# Altium project GumstixUAVBoard.PrjPcb
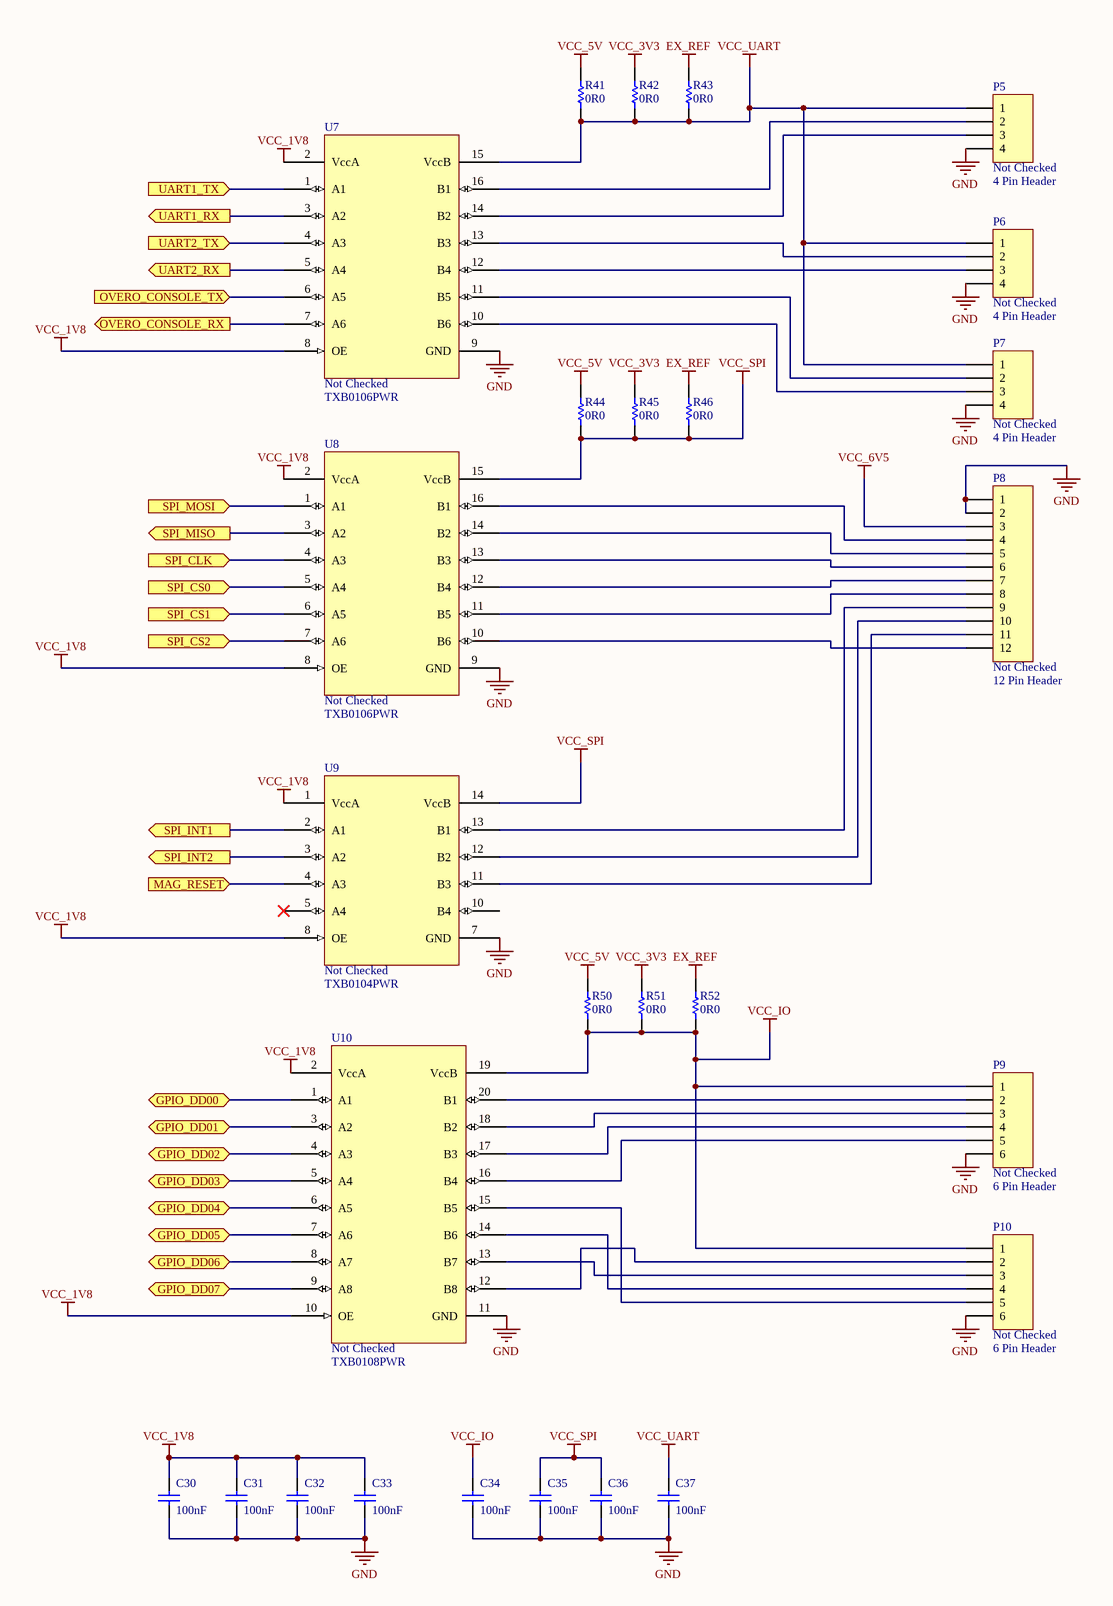
[diagram p0: Level Shifters.SchDoc]
5 sheets, 130 parts. Net scope: flat (ports and power ports of the same name join across sheets).
Board file: PCB1.PcbDoc
Sheets:
  Level Shifters.SchDoc
  Bus UART.SchDoc
  USB SPI I2C.SchDoc
  Power.SchDoc
  Overo.SchDoc

## Sheet Level Shifters.SchDoc
size A3 portrait; PageSetup: Record=PageOptions|CenterHorizontal=True|CenterVertical=True|PrintScale=1.00|XCorrection=1.00|YCorrection=1.00|PrintKind=1|BorderSize=5000000|LeftOffset=0|BottomOffset=0|Orientation=1|PaperLength=1000|PaperWidth=1000|Scale=100|PaperSource=7|PrintQuality=-4|MediaType=1|DitherType=10|PaperKind=A4|PrintScaleMode=1

### Parts
C30  100nF  [0603]
C31  100nF  [0603]
C32  100nF  [0603]
C33  100nF  [0603]
C34  100nF  [0603]
C35  100nF  [0603]
C36  100nF  [0603]
C37  100nF  [0603]
P5  Verify: Not Checked  [CONN_4X1_SMT_RA_1.25MM]  (hidden comment: 4 Pin Header)
P6  Verify: Not Checked  [CONN_4X1_SMT_RA_1.25MM]  (hidden comment: 4 Pin Header)
P7  Verify: Not Checked  [CONN_4X1_SMT_RA_1.25MM]  (hidden comment: 4 Pin Header)
P8  Verify: Not Checked  [CONN_12X1_SMT_RA_1.25MM]  (hidden comment: 12 Pin Header)
P9  Verify: Not Checked  [CONN_6X1_SMT_RA_1.25MM]  (hidden comment: 6 Pin Header)
P10  Verify: Not Checked  [CONN_6X1_SMT_RA_1.25MM]  (hidden comment: 6 Pin Header)
R41  0R0  [0603]  (no BOM)
R42  0R0  [0603]  (no BOM)
R43  0R0  [0603]  (no BOM)
R44  0R0  [0603]  (no BOM)
R45  0R0  [0603]  (no BOM)
R46  0R0  [0603]  (no BOM)
R50  0R0  [0603]  (no BOM)
R51  0R0  [0603]  (no BOM)
R52  0R0  [0603]  (no BOM)
U7  value TXB0106PWR  Verify: Not Checked  [TSSOP-16_PW]  (hidden comment: IC_TXB0106PWR)
U8  value TXB0106PWR  Verify: Not Checked  [TSSOP-16_PW]  (hidden comment: IC_TXB0106PWR)
U9  value TXB0104PWR  Verify: Not Checked  [TSSOP-14_PW]  (hidden comment: IC_TXB0104PWR)
U10  value TXB0108PWR  Verify: Not Checked  [TSSOP-20_PW]  (hidden comment: IC_TXB0108PWR)

### Ports
GPIO_DD00 (bidir), GPIO_DD01 (bidir), GPIO_DD02 (bidir), GPIO_DD03 (bidir), GPIO_DD04 (bidir), GPIO_DD05 (bidir), GPIO_DD06 (bidir), GPIO_DD07 (bidir), MAG_RESET (in), OVERO_CONSOLE_RX (out), OVERO_CONSOLE_TX (in), SPI_CLK (in), SPI_CS0 (in), SPI_CS1 (in), SPI_CS2 (in), SPI_INT1 (out), SPI_INT2 (out), SPI_MISO (out), SPI_MOSI (in), UART1_RX (out), UART1_TX (in), UART2_RX (out), UART2_TX (in)

### Nets
EX_REF: R43.1 R46.1 R52.1
GND: C30.1 C31.1 C32.1 C33.1 C34.1 C35.1 C36.1 C37.1 P5.4 P6.4 P7.4 P8.1 P8.2 P9.6 P10.6 U7.9(GND) U8.9(GND) U9.7(GND) U10.11(GND)
VCC_1V8: C30.2 C31.2 C32.2 C33.2 U7.2(VccA) U7.8(OE) U8.2(VccA) U8.8(OE) U9.1(VccA) U9.8(OE) U10.2(VccA) U10.10(OE)
VCC_3V3: R42.1 R45.1 R51.1
VCC_5V: R41.1 R44.1 R50.1
VCC_6V5: P8.3
VCC_IO: C34.2 P9.1 P10.1 R50.2 R51.2 R52.2 U10.19(VccB)
VCC_SPI: C35.2 C36.2 R44.2 R45.2 R46.2 U8.15(VccB) U9.14(VccB)
VCC_UART: C37.2 P5.1 P6.1 P7.1 R41.2 R42.2 R43.2 U7.15(VccB)
NetJP1_2: U10.3(A2) ; port GPIO_DD01
NetJP1_3: U10.1(A1) ; port GPIO_DD00
NetJP1_4: U10.5(A4) ; port GPIO_DD03
NetJP1_5: U10.7(A6) ; port GPIO_DD05
NetJP1_6: U10.4(A3) ; port GPIO_DD02
NetJP1_7: U10.6(A5) ; port GPIO_DD04
NetJP1_26: U7.6(A5) ; port OVERO_CONSOLE_TX
NetJP1_29: U10.9(A8) ; port GPIO_DD07
NetJP1_31: U7.7(A6) ; port OVERO_CONSOLE_RX
NetJP1_33: U10.8(A7) ; port GPIO_DD06
NetJP1_42_: U8.6(A5) ; port SPI_CS1
NetJP1_43_: U8.4(A3) ; port SPI_CLK
NetJP1_44_: U8.1(A1) ; port SPI_MOSI
NetJP1_45_: U8.3(A2) ; port SPI_MISO
NetJP1_57: U9.4(A3) ; port MAG_RESET
NetJP1_60: U9.3(A2) ; port SPI_INT2
NetJP1_61: U9.2(A1) ; port SPI_INT1
NetJP1__25: U8.7(A6) ; port SPI_CS2
NetJP1__27: U8.5(A4) ; port SPI_CS0
NetP5_2: P5.2 U7.16(B1)
NetP5_3: P5.3 U7.14(B2)
NetP6_2: P6.2 U7.13(B3)
NetP6_3: P6.3 U7.12(B4)
NetP7_2: P7.2 U7.11(B5)
NetP7_3: P7.3 U7.10(B6)
NetP8_4: P8.4 U8.16(B1)
NetP8_5: P8.5 U8.14(B2)
NetP8_6: P8.6 U8.13(B3)
NetP8_7: P8.7 U8.12(B4)
NetP8_8: P8.8 U8.11(B5)
NetP8_9: P8.9 U9.13(B1)
NetP8_10: P8.10 U9.12(B2)
NetP8_11: P8.11 U9.11(B3)
NetP8_12: P8.12 U8.10(B6)
NetP9_2: P9.2 U10.20(B1)
NetP9_3: P9.3 U10.18(B2)
NetP9_4: P9.4 U10.17(B3)
NetP9_5: P9.5 U10.16(B4)
NetP10_2: P10.2 U10.12(B8)
NetP10_3: P10.3 U10.13(B7)
NetP10_4: P10.4 U10.14(B6)
NetP10_5: P10.5 U10.15(B5)
NetU5_4: U7.5(A4) ; port UART2_RX
NetU5_5: U7.3(A2) ; port UART1_RX
NetU5_7: U7.1(A1) ; port UART1_TX
NetU5_8: U7.4(A3) ; port UART2_TX

Not connected (* = marked no-connect by the designer): U9 5(A4)* 10(B4)

### Library data of the parts
C30-C37 = CP_100nF 0603: CAP CER .10UF 50V X5R 0603; Manufacturer: Taiyo Yuden; Manufacturer PN: UMK107B7104KA-T; Prototype: Digikey 587-1243-1-ND; LatestRevisionDate: 29 May 08; Value: 100nF
P5-P7 = JP_4PIN HDR_SMT_RA_MOLEX: CONN HDR VERT 4POS .100" SNGL; Manufacturer: Molex; Manufacturer PN: 53261-0471; Prototype: Digikey WM7622CT-ND; LatestRevisionDate: 24 Jun 08; Value: 4 Pin Header
P8 = JP_12PIN HDR_SMT_RA_MOLEX: CONN HDR VERT 12POS .100" SNGL; Manufacturer: Molex; Manufacturer PN: 53261-1271; Prototype: Digikey WM7630CT-ND; LatestRevisionDate: 24 Jun 08; Value: 12 Pin Header
P9 P10 = JP_6PIN HDR_SMT_RA_MOLEX: CONN HDR VERT 6POS .100" SNGL; Manufacturer: Molex; Manufacturer PN: 53261-0671; Prototype: Digikey WM7624CT-ND; LatestRevisionDate: 24 Jun 08; Value: 6 Pin Header
R41-R46 R50-R52 = RS_0R0 0603: RES 0.0 OHM 1/10W 5% 0603 SMD; Manufacturer: Rohm; Manufacturer PN: MCR03EZPJ000; Prototype: DigiKey RHM0.0GCT-ND; LatestRevisionDate: 3 Jun 08; Value: 0R0
U7 U8 = IC_TXB0106PWR: IC VOLT-LEVEL TRANSLATOR 16TSSOP; Manufacturer: Texas Instruments; Prototype: Digikey 296-23759-1-ND; LastRevisionDate: n/a; Manufacturer PN: TXB0106PWR
U9 = IC_TXB0104PWR: IC VOLT-LEVEL TRANSLATOR 14TSSOP; Manufacturer: Texas Instruments; Prototype: Digikey 296-21929-1-ND; LastRevisionDate: n/a; Manufacturer PN: TXB0104PWR
U10 = IC_TXB0108PWR: IC VOLT-LEVEL TRANSLATOR 20TSSOP; Manufacturer: Texas Instruments; Prototype: Digikey 296-21527-1-ND; LastRevisionDate: n/a; Manufacturer PN: TXB0108PWR

## Sheet Bus UART.SchDoc
size A4
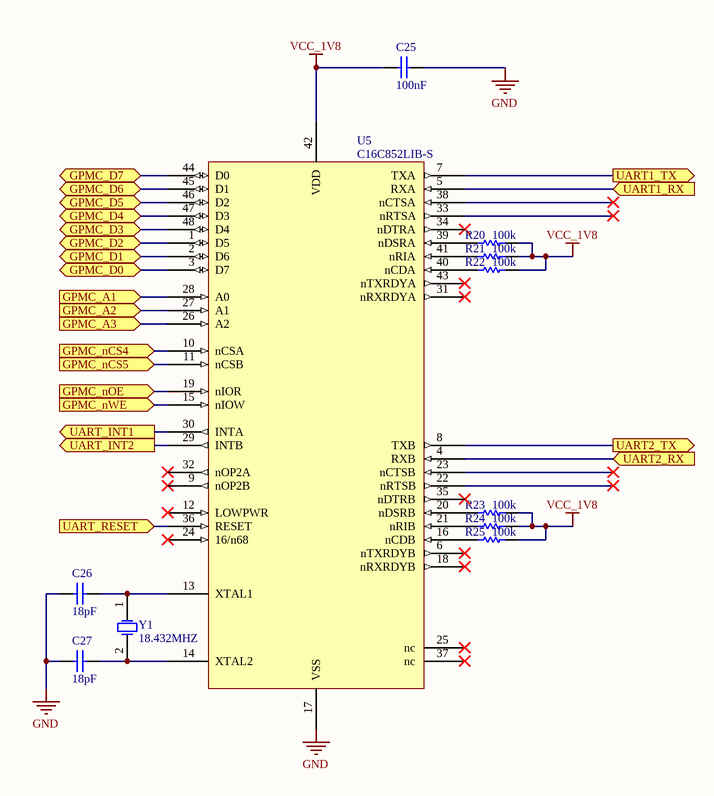
[diagram p1: Bus UART.SchDoc]

### Parts
C25  100nF  [0603]
C26  18pF  [0603]
C27  18pF  [0603]
R20  100k  [0603]
R21  100k  [0603]
R22  100k  [0603]
R23  100k  [0603]
R24  100k  [0603]
R25  100k  [0603]
U5  C16C852LIB-S  [LQFP-48]
Y1  18.432MHZ  [ConWin_Xtal]

### Ports
GPMC_A1 (in), GPMC_A2 (in), GPMC_A3 (in), GPMC_D0 (bidir), GPMC_D1 (bidir), GPMC_D2 (bidir), GPMC_D3 (bidir), GPMC_D4 (bidir), GPMC_D5 (bidir), GPMC_D6 (bidir), GPMC_D7 (bidir), GPMC_nCS4 (in), GPMC_nCS5 (in), GPMC_nOE (in), GPMC_nWE (in), UART1_RX (in), UART1_TX (out), UART2_RX (in), UART2_TX (out), UART_INT1 (out), UART_INT2 (out), UART_RESET (in)

### Nets
GND: C25.1 C26.1 C27.1 U5.17(VSS)
VCC_1V8: C25.2 R20.2 R21.2 R22.2 R23.2 R24.2 R25.2 U5.42(VDD)
NetC26_2: C26.2 U5.13(XTAL1) Y1.1(OSC1)
NetC27_2: C27.2 U5.14(XTAL2) Y1.2(OSC2)
NetJP1_37_: U5.29(INTB) ; port UART_INT2
NetJP1_38_: U5.30(INTA) ; port UART_INT1
NetJP1_49_: U5.44(D0) ; port GPMC_D7
NetJP1_51_: U5.45(D1) ; port GPMC_D6
NetJP1_53_: U5.2(D6) ; port GPMC_D1
NetJP1_56_: U5.3(D7) ; port GPMC_D0
NetJP1_58_: U5.28(A0) ; port GPMC_A1
NetJP1_59_: U5.26(A2) ; port GPMC_A3
NetJP1__4: U5.11(nCSB) ; port GPMC_nCS5
NetJP1__5: U5.10(nCSA) ; port GPMC_nCS4
NetJP1__6: U5.15(nIOW) ; port GPMC_nWE
NetJP1__8: U5.19(nIOR) ; port GPMC_nOE
NetJP1__10: U5.36(RESET) ; port UART_RESET
NetJP1__11: U5.27(A1) ; port GPMC_A2
NetJP1__15: U5.1(D5) ; port GPMC_D2
NetJP1__17: U5.48(D4) ; port GPMC_D3
NetJP1__19: U5.47(D3) ; port GPMC_D4
NetJP1__21: U5.46(D2) ; port GPMC_D5
NetR20_1: R20.1 U5.39(nDSRA)
NetR21_1: R21.1 U5.41(nRIA)
NetR22_1: R22.1 U5.40(nCDA)
NetR23_1: R23.1 U5.20(nDSRB)
NetR24_1: R24.1 U5.21(nRIB)
NetR25_1: R25.1 U5.16(nCDB)
NetU5_4: U5.4(RXB) ; port UART2_RX
NetU5_5: U5.5(RXA) ; port UART1_RX
NetU5_7: U5.7(TXA) ; port UART1_TX
NetU5_8: U5.8(TXB) ; port UART2_TX

Not connected (* = marked no-connect by the designer): U5 6(nTXRDYB)* 9(nOP2B)* 12(LOWPWR)* 18(nRXRDYB)* 22(nRTSB)* 23(nCTSB)* 24(16/n68)* 25(nc)* 31(nRXRDYA)* 32(nOP2A)* 33(nRTSA)* 34(nDTRA)* 35(nDTRB)* 37(nc)* 38(nCTSA)* 43(nTXRDYA)*

### Library data of the parts
C25 = CP_100nF 0603: as C30 on sheet Level Shifters; LatestRevisionDate: 29 May 08; Value: 100nF
C26 C27 = CP_18pF 0603: CAP CER 18PF 50V 5% C0G 0603; Manufacturer: Murata Electronics North America; Manufacturer PN: GRM1885C1H180JA01D; Prototype: Digikey 490-1409-1-ND; LatestRevisionDate: 1 Jun 08; Value: 18pF
R20-R25 = RS_100k 0603: RES 100K OHM 1/10W 1% 0603 SMD; Manufacturer: Yageo; Manufacturer PN: RC0603FR-07100KL; Prototype: DigiKey 311-100KHRCT-ND; LatestRevisionDate: 1 Jun 08; Value: 100k
U5 = IC_SC16C852LIB-S: Dual high speed UARTs, bus connected
Y1 = XT_18.432MHZ: CRYSTAL 18.432MHZ LOW PRO SMD; Manufacturer PN: XL-1C-18.4320; Manufacturer: Connor-Winfield; Prototype: Digikey CW404-ND; LatestRevisionDate: 29 May 08; Value: 18.432MHZ

## Sheet USB SPI I2C.SchDoc
size A3
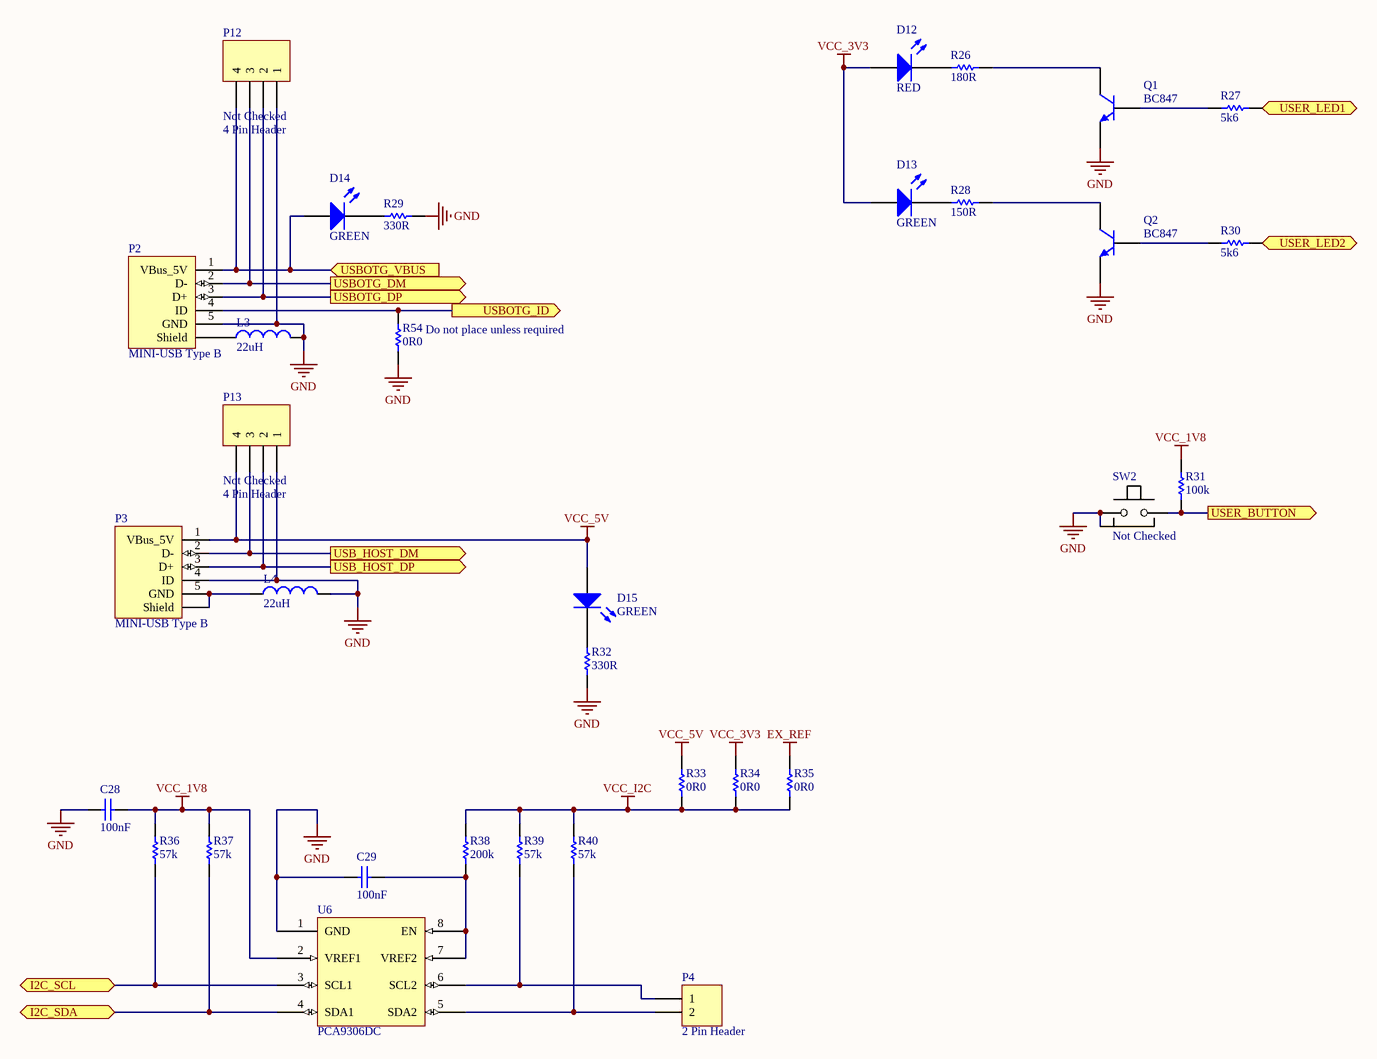
[diagram p2: USB SPI I2C.SchDoc]

### Parts
C28  100nF  [0603]
C29  100nF  [0603]
D12  value RED  [Diode_0805]  (hidden comment: LED Red)
D13  value GREEN  [Diode_0805]  (hidden comment: LED Green)
D14  value GREEN  [Diode_0805]  (hidden comment: LED Green)
D15  value GREEN  [Diode_0805]  (hidden comment: LED Green)
L3  22uH  [0805]
L4  22uH  [0805]
P2  MINI-USB Type B  [Hir_MINI_USB_B]
P3  MINI-USB Type B  [Hir_MINI_USB_B]
P4  2 Pin Header  [CONN_2X1_SMT_RA_1.25MM]
P12  Verify: Not Checked  [CONN_4X1_SMT_RA_1.25MM]  (hidden comment: 4 Pin Header)
P13  Verify: Not Checked  [CONN_4X1_SMT_RA_1.25MM]  (hidden comment: 4 Pin Header)
Q1  BC847  [SOT23]
Q2  BC847  [SOT23]
R26  180R  [0603]
R27  5k6  [0603]
R28  150R  [0603]
R29  330R  [0603]
R30  5k6  [0603]
R31  100k  [0603]
R32  330R  [0603]
R33  0R0  [0603]  (no BOM)
R34  0R0  [0603]  (no BOM)
R35  0R0  [0603]  (no BOM)
R36  57k  [0603]
R37  57k  [0603]
R38  200k  [0603]
R39  57k  [0603]
R40  57k  [0603]
R54  0R0  [0603]  (no BOM)
SW2  Verify: Not Checked  [PUSHBUTTON_B3U]  (hidden comment: Push Button Switch)
U6  PCA9306DC  [VSSOP-8]

### Ports
I2C_SCL (bidir), I2C_SDA (bidir), USB_HOST_DM (out), USB_HOST_DP (out), USBOTG_DM (out), USBOTG_DP (out), USBOTG_ID (out), USBOTG_VBUS (in), USER_BUTTON (out), USER_LED1 (in), USER_LED2 (in)

### Nets
EX_REF: R35.1
GND: C28.2 C29.2 L3.2 L4.2 P2.5(GND) P3.4(ID) P12.1 P13.1 Q1.2(E) Q2.2(E) R29.2 R32.1 R54.2 SW2.1 SW2.3(GND) U6.1(GND)
VCC_1V8: C28.1 R31.1 R36.2 R37.2 U6.2(VREF1)
VCC_3V3: D12.1(A) D13.1(A) R34.1
VCC_5V: D15.1(A) P3.1(VBus_5V) P13.4 R33.1
VCC_I2C: R33.2 R34.2 R35.2 R38.2 R39.2 R40.2
NetC29_1: C29.1 R38.1 U6.7(VREF2) U6.8(EN)
NetD12_2: D12.2(K) R26.1
NetD13_2: D13.2(K) R28.1
NetD14_1: D14.1(A) P2.1(VBus_5V) P12.4 ; port USBOTG_VBUS
NetD14_2: D14.2(K) R29.1
NetD15_2: D15.2(K) R32.2
NetJP1_10: R37.1 U6.4(SDA1) ; port I2C_SDA
NetJP1_13: R36.1 U6.3(SCL1) ; port I2C_SCL
NetJP1_22: R31.2 SW2.2 ; port USER_BUTTON
NetJP1_36: P2.3(D+) P12.2 ; port USBOTG_DP
NetJP1_37: P2.2(D-) P12.3 ; port USBOTG_DM
NetJP1_39_: R30.2 ; port USER_LED2
NetJP1_40_: R27.2 ; port USER_LED1
NetJP1_46: P2.4(ID) R54.1 ; port USBOTG_ID
NetJP1__34: P3.3(D+) P13.2 ; port USB_HOST_DP
NetJP1__35: P3.2(D-) P13.3 ; port USB_HOST_DM
NetL3_1: L3.1 P2.6(Shield)
NetL4_1: L4.1 P3.5(GND) P3.6(Shield)
NetP4_1: P4.1 R39.1 U6.6(SCL2)
NetP4_2: P4.2 R40.1 U6.5(SDA2)
NetQ1_1: Q1.1(B) R27.1
NetQ1_3: Q1.3(C) R26.2
NetQ2_1: Q2.1(B) R30.1
NetQ2_3: Q2.3(C) R28.2

### Notes on the sheet
- (near R54) Do not place unless required

### Library data of the parts
C28 C29 = CP_100nF 0603: as C30 on sheet Level Shifters; LatestRevisionDate: 29 May 08; Value: 100nF
D12 = DL_LED Red 0805: Red LED 0805; Manufacturer PN: TLMS2100-GS08; Manufacturer: Vishay; Prototype: Digikey 751-1183-1-ND
D13-D15 = DL_LED Green 0805: Green LED 0805; Prototype: Digikey 751-1166-1-ND; Verify: Not checked; DigiKey: TLMG2100-GS08; Category: Vishay
L3 L4 = IN_22uH 100mA 0805: Inductor 22uH 100mA 10% 0805; Manufacturer PN: GLF2012T220K; Manufacturer: TDK Corporation; Prototype: Digikey 445-3160-1-ND; LatestRevisionDate: 29 May 08; Value: 22uH
P2 P3 = JP_MINIUSB type B_1: MINI-USB Type B Single Connector; Manufacturer PN: UX60-MB-5ST; Manufacturer: Hirose Electric Co Ltd; Prototype: Digikey H2959CT-ND; LatestRevisionDate: 29 May 08; Value: MINI-USB Type B
P4 = JP_2PIN HDR_SMT_RA_MOLEX: CONN HDR VERT 2POS .100" SNGL; LatestRevisionDate: 24 Jun 08; Value: 2 Pin Header
P12 P13 = JP_4PIN HDR_SMT_RA_MOLEX: as P5 on sheet Level Shifters; LatestRevisionDate: 24 Jun 08; Value: 4 Pin Header
Q1 Q2 = TN_BC847: TRANS NPN GP 100MA 45V SOT23; Manufacturer: NXP Semiconductors; Manufacturer PN: BC847C T/R; Prototype: Digikey 568-1636-2-ND; LatestRevisionDate: 2  Jun 08; Value: BC847
R26 = RS_180R 0603: RES 180OHM 1/10W 1% 0603 SMD; Manufacturer: Panasonic - ECG; Manufacturer PN: ERJ-3EKF1800V; Prototype: DigiKey P180HCT-ND; LatestRevisionDate: 25 June 2009; Value: 180R
R27 R30 = RS_5k6 0603: RES 5.6K OHM 1/10W 5% 0603 SMD; Manufacturer: Yageo; Manufacturer PN: RC0603JR-075K6L; Prototype: DigiKey 311-5.6KGRCT-ND; LatestRevisionDate: 1 Jun 08; Value: 5k6
R28 = RS_150R 0603: RES 150 OHM 1/10W 1% 0603 SMD; Manufacturer: ROHM; Manufacturer PN: MCR03EZPFX1500; Prototype: DigiKey RHM150HCT-ND; LatestRevisionDate: 4th July 08; Value: 150R
R29 = RS_330R 0603: RES 330 OHM 1/10W 1% 0603 SMD; Manufacturer: Yageo; Manufacturer PN: RC0603FR-07330RL; Prototype: DigiKey 311-330HRCT-ND; LatestRevisionDate: 25 June 2009; Value: 330R
R31 R32 = RS_100k 0603: as R20 on sheet Bus UART; LatestRevisionDate: 1 Jun 08
  R31: Value: 100k
  R32: Value: 330R
R33-R35 R54 = RS_0R0 0603: as R41 on sheet Level Shifters; LatestRevisionDate: 3 Jun 08; Value: 0R0
R36-R40 = RS_10k 0603_1: RES 10.0K OHM 1/10W 1% 0603 SMD; Manufacturer: Yageo; Manufacturer PN: RC0603FR-0710KL; Prototype: DigiKey 311-10.0KHRCT-ND; LatestRevisionDate: 29 May 08
  R36 R37 R39 R40: Value: 57k
  R38: Value: 200k
SW2 = SW_TACT 3MM RT: SWITCH TACT RT ANG SPST SMD; Manufacturer: Omron; Manufacturer PN: B3U-3100P; Prototype: SW1023CT-ND; LatestRevisionDate: 22 Jun 08; Value: Push Button Switch
U6 = IC_PCA9306DC: IC LEVEL TRANSLATOR I2C BUS 8VSSOP; Manufacturer: NXP Semiconductor; Prototype: DigiKey 568-4213-1-ND; Manufacturer PN: PCA9306DC; LatestRevisionDate: 29 May 08; Value: PCA9306DC

## Sheet Power.SchDoc
size A4
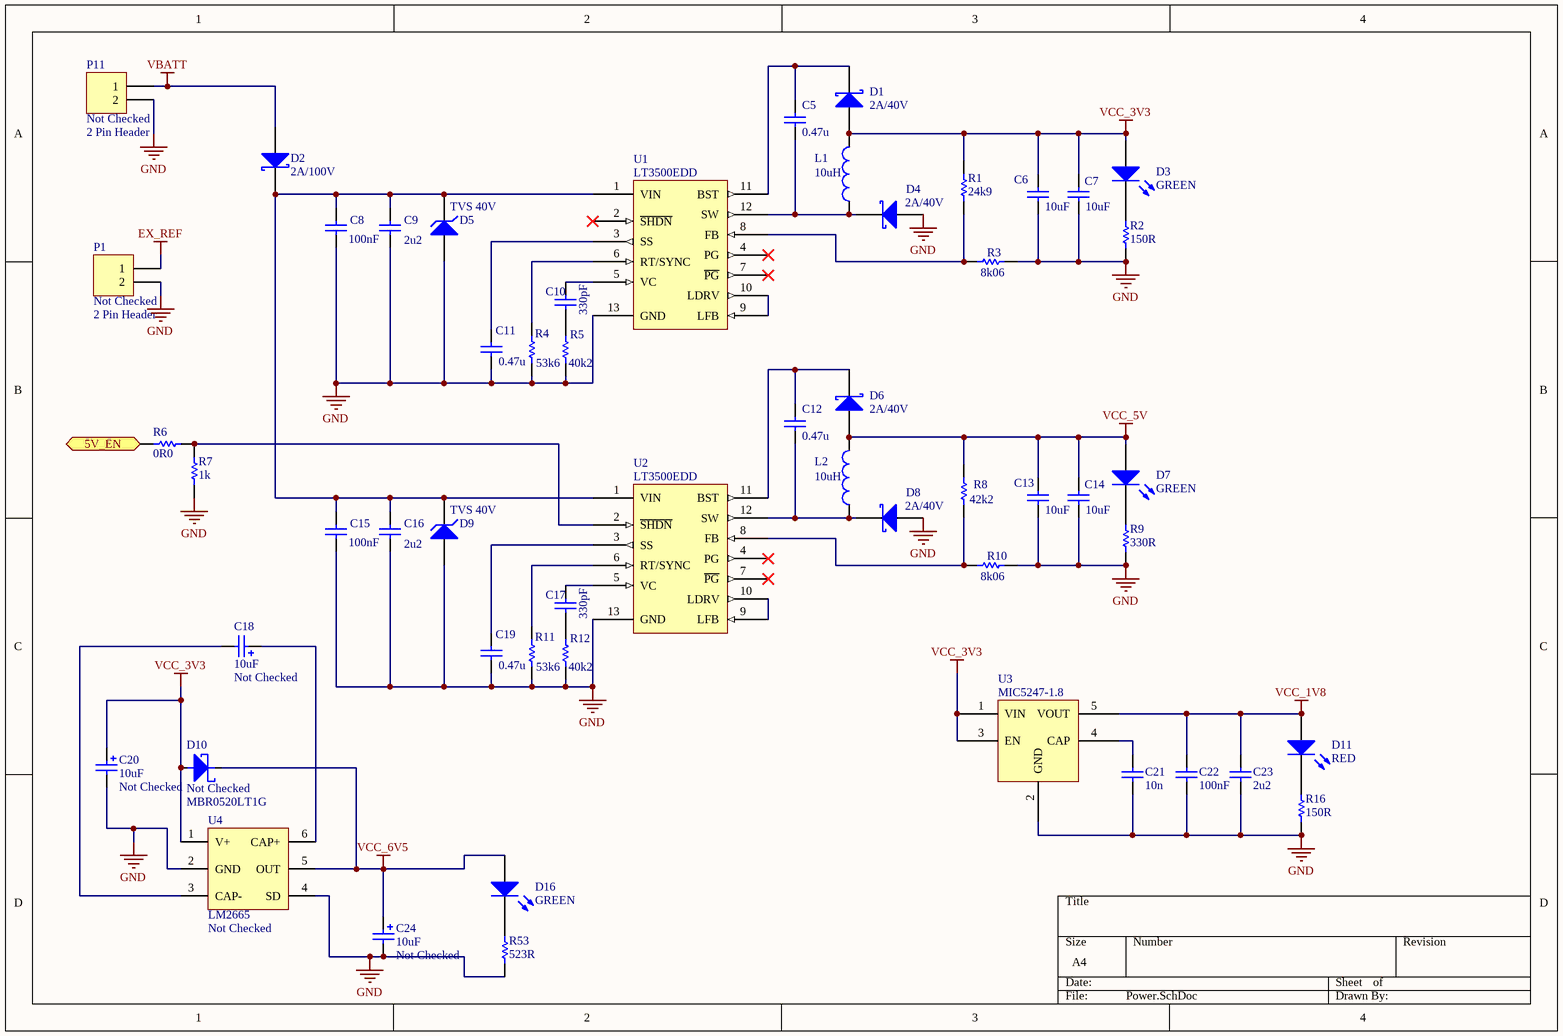
[diagram p3: Power.SchDoc]

### Parts
C5  value 0.47u  [0603]  (hidden comment: CP_470n 0603 25V X5R)
C6  10uF  [0805]
C7  10uF  [0805]
C8  100nF  [0603]
C9  value 2u2  [1206]  (hidden comment: CP_2u2 1206)
C10  value 330pF  [0603]  (hidden comment: CP_330pF 0603)
C11  value 0.47u  [0603]  (hidden comment: CP_470n 0603 25V X5R)
C12  value 0.47u  [0603]  (hidden comment: CP_470n 0603 25V X5R)
C13  10uF  [0805]
C14  10uF  [0805]
C15  100nF  [0603]
C16  value 2u2  [1206]  (hidden comment: CP_2u2 1206)
C17  value 330pF  [0603]  (hidden comment: CP_330pF 0603)
C18  Verify: Not Checked  [1206P]  (hidden comment: 10uF)
C19  value 0.47u  [0603]  (hidden comment: CP_470n 0603 25V X5R)
C20  Verify: Not Checked  [1206P]  (hidden comment: 10uF)
C21  10n  [0603]
C22  100nF  [0603]
C23  value 2u2  [1206]  (hidden comment: CP_2u2_50V_1206)
C24  Verify: Not Checked  [1206P]  (hidden comment: 10uF)
D1  2A/40V  [SMA_DIODE]
D2  2A/100V  [SMB_DIODE]
D3  value GREEN  [Diode_0805]  (hidden comment: LED Green)
D4  2A/40V  [SMA_DIODE]
D5  TVS 40V  [SMB_DIODE]
D6  2A/40V  [SMA_DIODE]
D7  value GREEN  [Diode_0805]  (hidden comment: LED Green)
D8  2A/40V  [SMA_DIODE]
D9  TVS 40V  [SMB_DIODE]
D10  Verify: Not Checked  [SOD123]  (hidden comment: MBR0520LT1G)
D11  value RED  [Diode_0805]  (hidden comment: LED Red)
D16  value GREEN  [Diode_0805]  (hidden comment: LED Green)
L1  10uH  [WE-PD]
L2  10uH  [WE-PD]
P1  Verify: Not Checked  [CONN_2X1_SMT_RA_1.25MM]  (hidden comment: 2 Pin Header)
P11  Verify: Not Checked  [POWER_PADS]  (hidden comment: 2 Pin Header)
R1  24k9  [0603]
R2  150R  [0603]
R3  8k06  [0603]
R4  53k6  [0603]
R5  40k2  [0603]
R6  0R0  [0603]  (no BOM)
R7  1k  [0603]
R8  42k2  [0603]
R9  330R  [0603]
R10  8k06  [0603]
R11  53k6  [0603]
R12  40k2  [0603]
R16  150R  [0603]
R53  523R  [0603]
U1  value LT3500EDD  [12-DFN]  (hidden comment: IC_LT3500EDD)
U2  value LT3500EDD  [12-DFN]  (hidden comment: IC_LT3500EDD)
U3  MIC5247-1.8  [SOT23-5]
U4  Verify: Not Checked  [SOT23-6]  (hidden comment: LM2665)

### Ports
5V_EN (in)

### Nets
EX_REF: P1.1
GND: C6.2 C7.2 C8.1 C9.2 C11.2 C13.2 C14.2 C15.1 C16.2 C19.2 C20.2 C21.1 C22.1 C23.1 C24.2 D4.1(A) D5.1(A) D8.1(A) D9.1(A) P1.2 P11.2 R2.1 R3.1 R4.1 R5.1 R7.1 R9.1 R10.1 R11.1 R12.1 R16.1 R53.2 U1.13(GND) U2.13(GND) U3.2(GND) U4.2(GND) U4.4(SD)
VBATT: D2.1(A) P11.1
VCC_1V8: C22.2 C23.2 D11.1(A) U3.5(VOUT)
VCC_3V3: C6.1 C7.1 C20.1 D1.1(A) D3.1(A) D10.1(A) L1.2 R1.2 U3.1(VIN) U3.3(EN) U4.1(V+)
VCC_5V: C13.1 C14.1 D6.1(A) D7.1(A) L2.2 R8.2
VCC_6V5: C24.1 D10.2(K) D16.1(A) U4.5(OUT)
NetC5_1: C5.1 D4.2(K) L1.1 U1.12(SW)
NetC5_2: C5.2 D1.2(K) U1.11(BST)
NetC8_2: C8.2 C9.1 C15.2 C16.1 D2.2(K) D5.2(K) D9.2(K) U1.1(VIN) U2.1(VIN)
NetC10_1: C10.1 U1.5(VC)
NetC10_2: C10.2 R5.2
NetC11_1: C11.1 U1.3(SS)
NetC12_1: C12.1 D8.2(K) L2.1 U2.12(SW)
NetC12_2: C12.2 D6.2(K) U2.11(BST)
NetC17_1: C17.1 U2.5(VC)
NetC17_2: C17.2 R12.2
NetC18_1: C18.1 U4.6(CAP+)
NetC18_2: C18.2 U4.3(CAP-)
NetC19_1: C19.1 U2.3(SS)
NetC21_2: C21.2 U3.4(CAP)
NetD3_2: D3.2(K) R2.2
NetD7_2: D7.2(K) R9.2
NetD11_2: D11.2(K) R16.2
NetD16_2: D16.2(K) R53.1
NetJP1__28: R6.2 ; port 5V_EN
NetR1_1: R1.1 R3.2 U1.8(FB)
NetR4_2: R4.2 U1.6(RT/SYNC)
NetR6_1: R6.1 R7.2 U2.2(~{SHDN})
NetR8_1: R8.1 R10.2 U2.8(FB)
NetR11_2: R11.2 U2.6(RT/SYNC)
NetU1_9: U1.9(LFB) U1.10(LDRV)
NetU2_9: U2.9(LFB) U2.10(LDRV)

Not connected (* = marked no-connect by the designer): U1 2(~{SHDN})* 4(PG)* 7(~{PG})*; U2 4(PG)* 7(~{PG})*

### Library data of the parts
C5 C11 C12 C19 = CP_470n 0603 25V X5R: CAP CER .47UF 25V X5R 0603; Manufacturer: Taiyo Yuden; Manufacturer PN: TMK107BJ474KA-T; Prototype: Digikey 587-1247-1-ND; Published: 8-Jun-2000; LatestRevisionDate: 17-Jul-2002; LatestRevisionNote: Re-released for DXP Platform.; PackageReference: RAD-0.3; Publisher: Altium Limited
C6 C7 C13 C14 = CP_10uF 0805: CAP 10uF 10% 10V X5R 0805; Manufacturer: Murata; Manufacturer PN: GRM219R61A106KE44D; Prototype: Digikey 490-4735-2-ND; LatestRevisionDate: 29 May 08; Value: 10uF
C8 C15 C21 C22 = CP_100nF 0603: as C30 on sheet Level Shifters; LatestRevisionDate: 29 May 08
  C8 C15 C22: Value: 100nF
  C21: Value: 10n
C9 C16 = CP_2u2 1206: CAP CER 2u2 50V Y5V 1206; Manufacturer: Taiyo Yuden; Manufacturer PN: UMK316F225ZG-T; Prototype: Digikey 587-1351-1-ND; LatestRevisionDate: 29 May 08
C10 C17 = CP_330pF 0603: CAP 330PF 50V CERAMIC X7R 0603; Manufacturer: Yageo; Manufacturer PN: CC0603KRX7R9BB331; Prototype: Digikey 311-1186-1-ND; LatestRevisionDate: 17-Jul-2002
C18 C20 C24 = CP_TANT_10uF_1206: CAP 10uF 20% 10V 300mOhm 1206; Manufacturer: AVX; Manufacturer PN: TCJA106M010R0300; Prototype: Digikey 478-3127-1-ND; Modified Date: 11 Jun 09; LatestRevisionDate: 11 Jun 09; Value: 10uF
C23 = CP_2u2_50V_1206: CAP CER 2u2 50V Y5V 1206; Manufacturer: Taiyo Yuden; Manufacturer PN: UMK316F225ZG-T; Prototype: Digikey 587-1351-1-ND; LatestRevisionDate: 29 May 08
D1 D4 D6 D8 = DS_B240A-13-F: Schottky Diode - 2A/40V; Manufacturer: Diodes Inc; Prototype: DigiKey B240A-FDICT-ND; LatestRevisionDate: 29 May 08; Value: 2A/40V; Manufacturer PN: B240A-13-F
D2 = DS_SS2H10-E3/52T: Schottky Diode - 2A/100V; Manufacturer: Vishay/General Semiconductor; Prototype: DigiKey SS2H10-E3/52TGICT-ND; LatestRevisionDate: 29 may 08; Value: 2A/100V; Manufacturer PN: SS2H10-E3/52T
D3 D7 D16 = DL_LED Green 0805: as D13 on sheet USB SPI I2C; DigiKey: TLMG2100-GS08; Category: Vishay
D5 D9 = DZ_40v TVS: DIODE TVS 40V 600W UNIDIR  SMB; Manufacturer: LittelFuse; Manufacturer PN: SMBJ36A; Prototype: Digikey   SMBJ36ALFCT-ND; LatestRevisionDate: 29 May 08; Value: TVS 40V
D10 = DS_MBR0520LT1G: DIODE SCHOTTKY 20V 0.5A SOD123; Manufacturer: ON Semiconductor; Prototype: Digikey MBR0520LT1GOSCT-ND; Value: MBR0520LT1G; Manufacturer PN: MBR0520LT1G
D11 = DL_LED 1.7V Red 0805: Red LED 1.7V 0805; Manufacturer PN: 7012X1; Manufacturer: CML; Prototype: Digikey L61101CT-ND
L1 L2 = IN_10uH 2A SMT: INDUCTOR POWER 10UH 2.0A SMD; Manufacturer: Wurth Electronics Inc; Manufacturer PN: 744777910; Prototype: Digikey 732-1191-1-ND; LatestRevisionDate: 29 May 08; Value: 10uH
P1 = JP_2PIN HDR_SMT_RA_MOLEX: CONN HDR VERT 2POS .100" SNGL; Manufacturer: Molex; Manufacturer PN: 53261-0271; Prototype: Digikey WM7620CT-ND; LatestRevisionDate: 24 Jun 08; Value: 2 Pin Header
P11 = JP_2PIN HDR_SMT_RA_MOLEX: LatestRevisionDate: 24 Jun 08; Value: 2 Pin Header
R1 = RS_24k9 0603: RES 24.9K OHM 1/10W 1% 0603 SMD; Manufacturer: ROHM; Manufacturer PN: MCR03EZPFX2492; Prototype: DigiKey RHM24.9KHCT-ND; LatestRevisionDate: 29 May 08; Value: 24k9
R2 = RS_150R 0603: as R28 on sheet USB SPI I2C; LatestRevisionDate: 4th July 08; Value: 150R
R3 R10 = RS_8k06 0603: RES 8k06 OHM 1/10W 1% 0603 SMD; Manufacturer: ROHM; Manufacturer PN: MCR03EZPFX8061; Prototype: DigiKey RHM8.06KHCT-ND; LatestRevisionDate: 29 May 08; Value: 8k06
R4 R11 = RS_53k6 0603: RES 53.6K OHM 1/10W 1% 0603 SMD; Manufacturer: ROHM; Manufacturer PN: MCR03EZPFX5362; Prototype: DigiKey RHM53.6KHCT-ND; LatestRevisionDate: 29 May 08; Value: 53k6
R5 R12 = RS_40k2 0603: RES 40.2K OHM 1/10W 1% 0603 SMD; Manufacturer: ROHM; Manufacturer PN: MCR03EZPFX4022; Prototype: Digikey RHM40.2KHCT-ND; LatestRevisionDate: 29 May 08; Value: 40k2
R6 = RS_0R0 0603: as R41 on sheet Level Shifters; LatestRevisionDate: 3 Jun 08; Value: 0R0
R7 = RS_1k 0603: RES 1.00K OHM 1/10W 1% 0603 SMD; Manufacturer: ROHM; Manufacturer PN: MCR03EZPFX1001; Prototype: Digikey RHM1.00KHCT-ND; LatestRevisionDate: 17-Jul-2002; Value: 1k
R8 = RS_42k2 0603: RES 42.2K OHM 1/10W 1% 0603 SMD; Manufacturer: ROHM; Manufacturer PN: MCR03EZPFX4222; Prototype: DigiKey RHM42.2KHCT-ND; LatestRevisionDate: 29 May 08; Value: 42k2
R9 = RS_330R 0603: as R29 on sheet USB SPI I2C; LatestRevisionDate: 25 June 2009; Value: 330R
R16 = RS_100k 0603: as R20 on sheet Bus UART; LatestRevisionDate: 1 Jun 08; Value: 150R
R53 = RS_523R 0603: RES 523 OHM 1/10W 1% 0603 SMD; Manufacturer: Yageo; Manufacturer PN: RC0603FR-07523RL; Prototype: DigiKey 311-523HRCT-ND; LatestRevisionDate: 25 June 2009; Value: 523R
U1 U2 = IC_LT3500EDD: IC REG STP-DWN 2A 12-DFN; Manufacturer: Linear Technology; Manufacturer PN: LT3500EDD#PBF; Prototype: DigiKey LT3500EDD#PBF-ND; Published: 24-Mar-1999; LatestRevisionDate: 17-Jul-2002; LatestRevisionNote: Re-released for DXP Platform.; PackageReference: SPST-2; Publisher: Altium Limited
U3 = IC_MIC5247-1.8YM5: 1.8V linear regulator; Manufacturer: Micrel; Manufacturer PN: MIC5247-1.8YM5 TR; Prototype: Digikey 576-1288-1-ND; LatestRevisionDate: 25 June 2009
U4 = IC_LM2665: Switched Capacitor Voltage Converter; Manufacturer: National Semiconductor; Manufacturer PN: LM2665M6/NOPB; Prototype: Digikey LM2665M6CT-ND; LatestRevisionDate: 11 June 09; Value: LM2665

## Sheet Overo.SchDoc
size A4
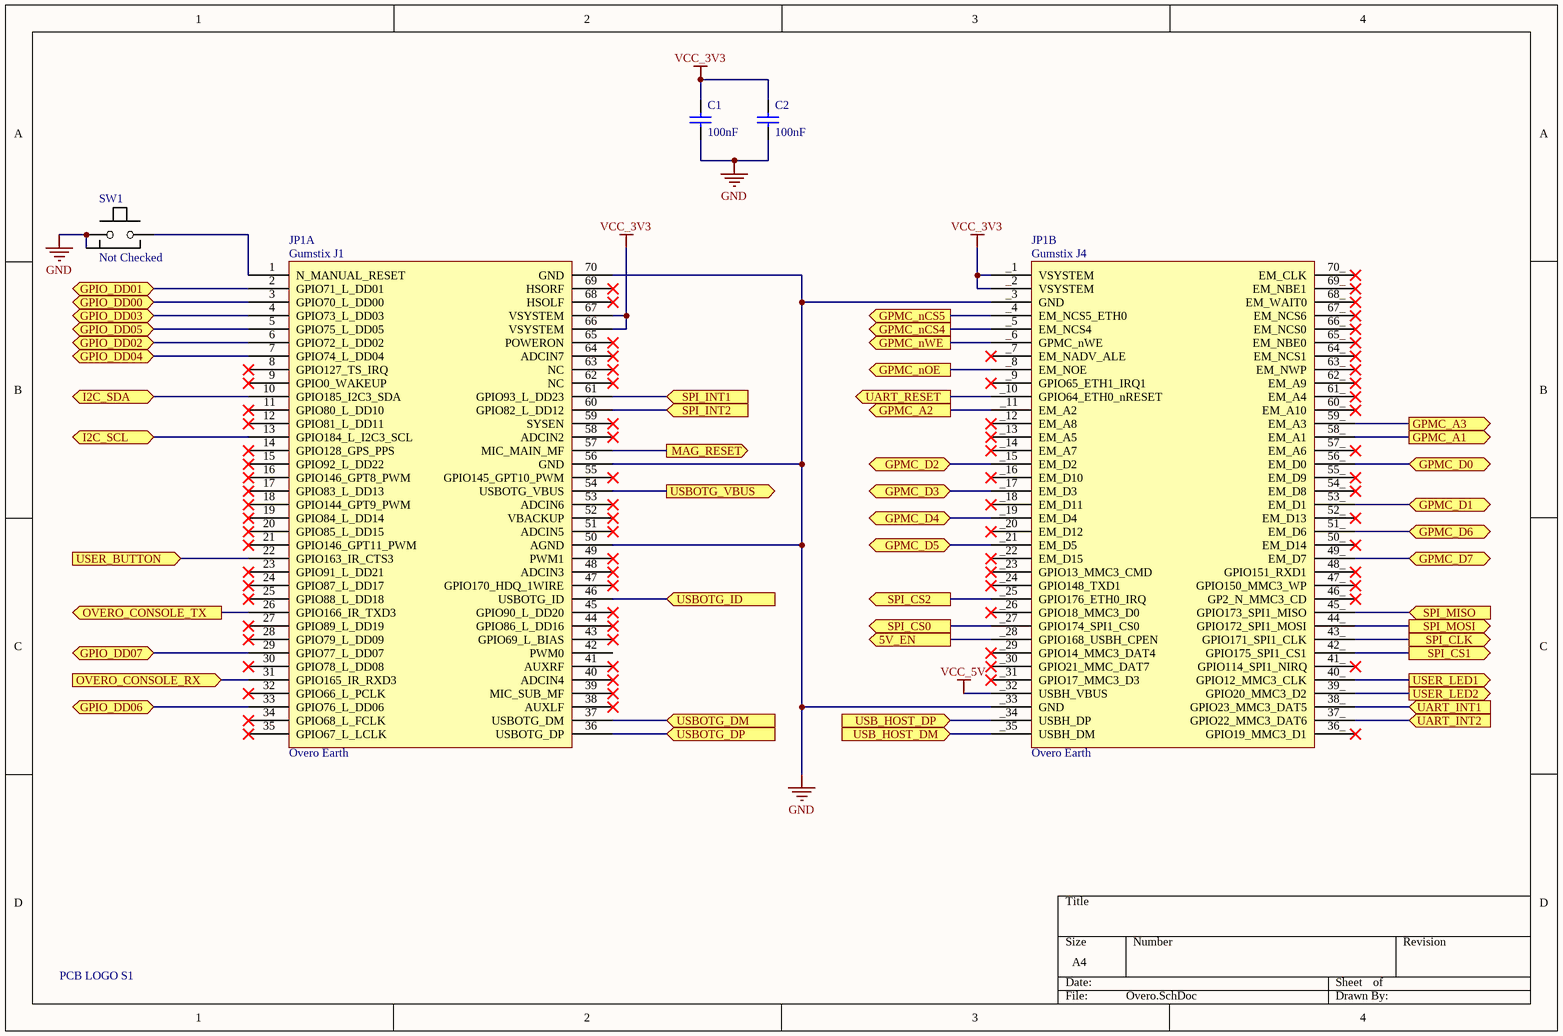
[diagram p4: Overo.SchDoc]

### Parts
C1  100nF  [0603]
C2  100nF  [0603]
JP1  Overo Earth  (parts A,B of 2)
PCB_LOGO_S1  GRC_LOGO_SMALL  [GRC_LOGO_20x10MM]  (value not drawn)
SW1  Verify: Not Checked  [PUSHBUTTON_B3U]  (hidden comment: Push Button Switch)

### Ports
5V_EN (out), GPIO_DD00 (bidir), GPIO_DD01 (bidir), GPIO_DD02 (bidir), GPIO_DD03 (bidir), GPIO_DD04 (bidir), GPIO_DD05 (bidir), GPIO_DD06 (bidir), GPIO_DD07 (bidir), GPMC_A1 (out), GPMC_A2 (out), GPMC_A3 (out), GPMC_D0 (bidir), GPMC_D1 (bidir), GPMC_D2 (bidir), GPMC_D3 (bidir), GPMC_D4 (bidir), GPMC_D5 (bidir), GPMC_D6 (bidir), GPMC_D7 (bidir), GPMC_nCS4 (out), GPMC_nCS5 (out), GPMC_nOE (out), GPMC_nWE (out), I2C_SCL (bidir), I2C_SDA (bidir), MAG_RESET (out), OVERO_CONSOLE_RX (in), OVERO_CONSOLE_TX (out), SPI_CLK (out), SPI_CS0 (out), SPI_CS1 (out), SPI_CS2 (out), SPI_INT1 (in), SPI_INT2 (in), SPI_MISO (in), SPI_MOSI (out), UART_INT1 (in), UART_INT2 (in), UART_RESET (out), USB_HOST_DM (in), USB_HOST_DP (in), USBOTG_DM (in), USBOTG_DP (in), USBOTG_ID (in), USBOTG_VBUS (out), USER_BUTTON (in), USER_LED1 (out), USER_LED2 (out)

### Nets
GND: C1.1 C2.1 JP1.50(AGND) JP1.56(GND) JP1.70(GND) JP1._3(GND) JP1._33(GND) SW1.1 SW1.3(GND)
VCC_3V3: C1.2 C2.2 JP1.66(VSYSTEM) JP1.67(VSYSTEM) JP1._1(VSYSTEM) JP1._2(VSYSTEM)
VCC_5V: JP1._32(USBH_VBUS)
NetD14_1: JP1.54(USBOTG_VBUS) ; port USBOTG_VBUS
NetJP1_1: JP1.1(N_MANUAL_RESET) SW1.2
NetJP1_2: JP1.2(GPIO71_L_DD01) ; port GPIO_DD01
NetJP1_3: JP1.3(GPIO70_L_DD00) ; port GPIO_DD00
NetJP1_4: JP1.4(GPIO73_L_DD03) ; port GPIO_DD03
NetJP1_5: JP1.5(GPIO75_L_DD05) ; port GPIO_DD05
NetJP1_6: JP1.6(GPIO72_L_DD02) ; port GPIO_DD02
NetJP1_7: JP1.7(GPIO74_L_DD04) ; port GPIO_DD04
NetJP1_10: JP1.10(GPIO185_I2C3_SDA) ; port I2C_SDA
NetJP1_13: JP1.13(GPIO184_L_I2C3_SCL) ; port I2C_SCL
NetJP1_22: JP1.22(GPIO163_IR_CTS3) ; port USER_BUTTON
NetJP1_26: JP1.26(GPIO166_IR_TXD3) ; port OVERO_CONSOLE_TX
NetJP1_29: JP1.29(GPIO77_L_DD07) ; port GPIO_DD07
NetJP1_31: JP1.31(GPIO165_IR_RXD3) ; port OVERO_CONSOLE_RX
NetJP1_33: JP1.33(GPIO76_L_DD06) ; port GPIO_DD06
NetJP1_36: JP1.36(USBOTG_DP) ; port USBOTG_DP
NetJP1_37: JP1.37(USBOTG_DM) ; port USBOTG_DM
NetJP1_37_: JP1.37_(GPIO22_MMC3_DAT6) ; port UART_INT2
NetJP1_38_: JP1.38_(GPIO23_MMC3_DAT5) ; port UART_INT1
NetJP1_39_: JP1.39_(GPIO20_MMC3_D2) ; port USER_LED2
NetJP1_40_: JP1.40_(GPIO12_MMC3_CLK) ; port USER_LED1
NetJP1_42_: JP1.42_(GPIO175_SPI1_CS1) ; port SPI_CS1
NetJP1_43_: JP1.43_(GPIO171_SPI1_CLK) ; port SPI_CLK
NetJP1_44_: JP1.44_(GPIO172_SPI1_MOSI) ; port SPI_MOSI
NetJP1_45_: JP1.45_(GPIO173_SPI1_MISO) ; port SPI_MISO
NetJP1_46: JP1.46(USBOTG_ID) ; port USBOTG_ID
NetJP1_49_: JP1.49_(EM_D7) ; port GPMC_D7
NetJP1_51_: JP1.51_(EM_D6) ; port GPMC_D6
NetJP1_53_: JP1.53_(EM_D1) ; port GPMC_D1
NetJP1_56_: JP1.56_(EM_D0) ; port GPMC_D0
NetJP1_57: JP1.57(MIC_MAIN_MF) ; port MAG_RESET
NetJP1_58_: JP1.58_(EM_A1) ; port GPMC_A1
NetJP1_59_: JP1.59_(EM_A3) ; port GPMC_A3
NetJP1_60: JP1.60(GPIO82_L_DD12) ; port SPI_INT2
NetJP1_61: JP1.61(GPIO93_L_DD23) ; port SPI_INT1
NetJP1__4: JP1._4(EM_NCS5_ETH0) ; port GPMC_nCS5
NetJP1__5: JP1._5(EM_NCS4) ; port GPMC_nCS4
NetJP1__6: JP1._6(GPMC_nWE) ; port GPMC_nWE
NetJP1__8: JP1._8(EM_NOE) ; port GPMC_nOE
NetJP1__10: JP1._10(GPIO64_ETH0_nRESET) ; port UART_RESET
NetJP1__11: JP1._11(EM_A2) ; port GPMC_A2
NetJP1__15: JP1._15(EM_D2) ; port GPMC_D2
NetJP1__17: JP1._17(EM_D3) ; port GPMC_D3
NetJP1__19: JP1._19(EM_D4) ; port GPMC_D4
NetJP1__21: JP1._21(EM_D5) ; port GPMC_D5
NetJP1__25: JP1._25(GPIO176_ETH0_IRQ) ; port SPI_CS2
NetJP1__27: JP1._27(GPIO174_SPI1_CS0) ; port SPI_CS0
NetJP1__28: JP1._28(GPIO168_USBH_CPEN) ; port 5V_EN
NetJP1__34: JP1._34(USBH_DP) ; port USB_HOST_DP
NetJP1__35: JP1._35(USBH_DM) ; port USB_HOST_DM

Not connected (* = marked no-connect by the designer): JP1 8(GPIO127_TS_IRQ)* 9(GPIO0_WAKEUP)* 11(GPIO80_L_DD10)* 12(GPIO81_L_DD11)* 14(GPIO128_GPS_PPS)* 15(GPIO92_L_DD22)* 16(GPIO146_GPT8_PWM)* 17(GPIO83_L_DD13)* 18(GPIO144_GPT9_PWM)* 19(GPIO84_L_DD14)* 20(GPIO85_L_DD15)* 21(GPIO146_GPT11_PWM)* 23(GPIO91_L_DD21)* 24(GPIO87_L_DD17)* 25(GPIO88_L_DD18)* 27(GPIO89_L_DD19)* 28(GPIO79_L_DD09)* 30(GPIO78_L_DD08)* 32(GPIO66_L_PCLK)* 34(GPIO68_L_FCLK)* 35(GPIO67_L_LCLK)* 36_(GPIO19_MMC3_D1)* 38(AUXLF)* 39(MIC_SUB_MF)* 40(ADCIN4)* 41(AUXRF)* 41_(GPIO114_SPI1_NIRQ)* 42(PWM0) 43(GPIO69_L_BIAS)* 44(GPIO86_L_DD16)* 45(GPIO90_L_DD20)* 46_(GP2_N_MMC3_CD)* 47(GPIO170_HDQ_1WIRE)* 47_(GPIO150_MMC3_WP)* 48(ADCIN3)* 48_(GPIO151_RXD1)* 49(PWM1)* 50_(EM_D14)* 51(ADCIN5)* 52(VBACKUP)* 52_(EM_D13)* 53(ADCIN6)* 54_(EM_D8)* 55(GPIO145_GPT10_PWM)* 55_(EM_D9)* 57_(EM_A6)* 58(ADCIN2)* 59(SYSEN)* 60_(EM_A10)* 61_(EM_A4)* 62(NC)* 62_(EM_A9)* 63(NC)* 63_(EM_NWP)* 64(ADCIN7)* 64_(EM_NCS1)* 65(POWERON)* 65_(EM_NBE0)* 66_(EM_NCS0)* 67_(EM_NCS6)* 68(HSOLF)* 68_(EM_WAIT0)* 69(HSORF)* 69_(EM_NBE1)* 70_(EM_CLK)* _7(EM_NADV_ALE)* _9(GPIO65_ETH1_IRQ1)* _12(EM_A8)* _13(EM_A5)* _14(EM_A7)* _16(EM_D10)* _18(EM_D11)* _20(EM_D12)* _22(EM_D15)* _23(GPIO13_MMC3_CMD)* _24(GPIO148_TXD1)* _26(GPIO18_MMC3_D0)* _29(GPIO14_MMC3_DAT4)* _30(GPIO21_MMC_DAT7)* _31(GPIO17_MMC3_D3)*

### Notes on the sheet
- (in symbol UN_GUMSTIX_OVERO_EARTH, part A) Gumstix J1
- (in symbol UN_GUMSTIX_OVERO_EARTH, part B) Gumstix J4

### Library data of the parts
C1 C2 = CP_100nF 0603: as C30 on sheet Level Shifters; LatestRevisionDate: 29 May 08; Value: 100nF
JP1 = UN_GUMSTIX_OVERO_EARTH: Gumstix Overo OMAP35xx Computer Module
PCB_LOGO_S1 = GRC_LOGO_SMALL: GRC Logo 20x10mm; Published: 24-Mar-1999; LatestRevisionDate: 17-Jul-2002; LatestRevisionNote: Re-released for DXP Platform.; PackageReference: SPST-2; Publisher: Altium Limited
SW1 = SW_TACT 3MM RT: as SW2 on sheet USB SPI I2C; LatestRevisionDate: 22 Jun 08; Value: Push Button Switch

## Nets that join several sheets
EX_REF: Level Shifters (R43.1 R46.1 R52.1), USB SPI I2C (R35.1), Power (P1.1)
GND: Level Shifters (19 pins), Bus UART (C25.1 C26.1 C27.1 U5.17), USB SPI I2C (16 pins), Power (37 pins), Overo (9 pins)
VCC_1V8: Level Shifters (12 pins), Bus UART (8 pins), USB SPI I2C (5 pins), Power (C22.2 C23.2 D11.1 U3.5)
VCC_3V3: Level Shifters (R42.1 R45.1 R51.1), USB SPI I2C (D12.1 D13.1 R34.1), Power (11 pins), Overo (6 pins)
VCC_5V: Level Shifters (R41.1 R44.1 R50.1), USB SPI I2C (D15.1 P3.1 P13.4 R33.1), Power (6 pins), Overo (JP1._32)
VCC_6V5: Level Shifters (P8.3), Power (C24.1 D10.2 D16.1 U4.5)
NetD14_1: USB SPI I2C (D14.1 P2.1 P12.4), Overo (JP1.54)
NetJP1_2: Level Shifters (U10.3), Overo (JP1.2)
NetJP1_3: Level Shifters (U10.1), Overo (JP1.3)
NetJP1_4: Level Shifters (U10.5), Overo (JP1.4)
NetJP1_5: Level Shifters (U10.7), Overo (JP1.5)
NetJP1_6: Level Shifters (U10.4), Overo (JP1.6)
NetJP1_7: Level Shifters (U10.6), Overo (JP1.7)
NetJP1_10: USB SPI I2C (R37.1 U6.4), Overo (JP1.10)
NetJP1_13: USB SPI I2C (R36.1 U6.3), Overo (JP1.13)
NetJP1_22: USB SPI I2C (R31.2 SW2.2), Overo (JP1.22)
NetJP1_26: Level Shifters (U7.6), Overo (JP1.26)
NetJP1_29: Level Shifters (U10.9), Overo (JP1.29)
NetJP1_31: Level Shifters (U7.7), Overo (JP1.31)
NetJP1_33: Level Shifters (U10.8), Overo (JP1.33)
NetJP1_36: USB SPI I2C (P2.3 P12.2), Overo (JP1.36)
NetJP1_37: USB SPI I2C (P2.2 P12.3), Overo (JP1.37)
NetJP1_37_: Bus UART (U5.29), Overo (JP1.37_)
NetJP1_38_: Bus UART (U5.30), Overo (JP1.38_)
NetJP1_39_: USB SPI I2C (R30.2), Overo (JP1.39_)
NetJP1_40_: USB SPI I2C (R27.2), Overo (JP1.40_)
NetJP1_42_: Level Shifters (U8.6), Overo (JP1.42_)
NetJP1_43_: Level Shifters (U8.4), Overo (JP1.43_)
NetJP1_44_: Level Shifters (U8.1), Overo (JP1.44_)
NetJP1_45_: Level Shifters (U8.3), Overo (JP1.45_)
NetJP1_46: USB SPI I2C (P2.4 R54.1), Overo (JP1.46)
NetJP1_49_: Bus UART (U5.44), Overo (JP1.49_)
NetJP1_51_: Bus UART (U5.45), Overo (JP1.51_)
NetJP1_53_: Bus UART (U5.2), Overo (JP1.53_)
NetJP1_56_: Bus UART (U5.3), Overo (JP1.56_)
NetJP1_57: Level Shifters (U9.4), Overo (JP1.57)
NetJP1_58_: Bus UART (U5.28), Overo (JP1.58_)
NetJP1_59_: Bus UART (U5.26), Overo (JP1.59_)
NetJP1_60: Level Shifters (U9.3), Overo (JP1.60)
NetJP1_61: Level Shifters (U9.2), Overo (JP1.61)
NetJP1__4: Bus UART (U5.11), Overo (JP1._4)
NetJP1__5: Bus UART (U5.10), Overo (JP1._5)
NetJP1__6: Bus UART (U5.15), Overo (JP1._6)
NetJP1__8: Bus UART (U5.19), Overo (JP1._8)
NetJP1__10: Bus UART (U5.36), Overo (JP1._10)
NetJP1__11: Bus UART (U5.27), Overo (JP1._11)
NetJP1__15: Bus UART (U5.1), Overo (JP1._15)
NetJP1__17: Bus UART (U5.48), Overo (JP1._17)
NetJP1__19: Bus UART (U5.47), Overo (JP1._19)
NetJP1__21: Bus UART (U5.46), Overo (JP1._21)
NetJP1__25: Level Shifters (U8.7), Overo (JP1._25)
NetJP1__27: Level Shifters (U8.5), Overo (JP1._27)
NetJP1__28: Power (R6.2), Overo (JP1._28)
NetJP1__34: USB SPI I2C (P3.3 P13.2), Overo (JP1._34)
NetJP1__35: USB SPI I2C (P3.2 P13.3), Overo (JP1._35)
NetU5_4: Level Shifters (U7.5), Bus UART (U5.4)
NetU5_5: Level Shifters (U7.3), Bus UART (U5.5)
NetU5_7: Level Shifters (U7.1), Bus UART (U5.7)
NetU5_8: Level Shifters (U7.4), Bus UART (U5.8)